# Altium schematic sheet PSFB_gate_driver_sch.SchDoc
size 420 x 297 mm; Address1: Address1; Address2: Address2; Address3: Address3; Address4: Address4; DocumentNumber: АБВГ.123456.001 Э3; SheetNumber: 1; Scale: 1:1; DocumentType: Схема электрическая принципиальная; FirstReferrence: АБВГ.123456.001
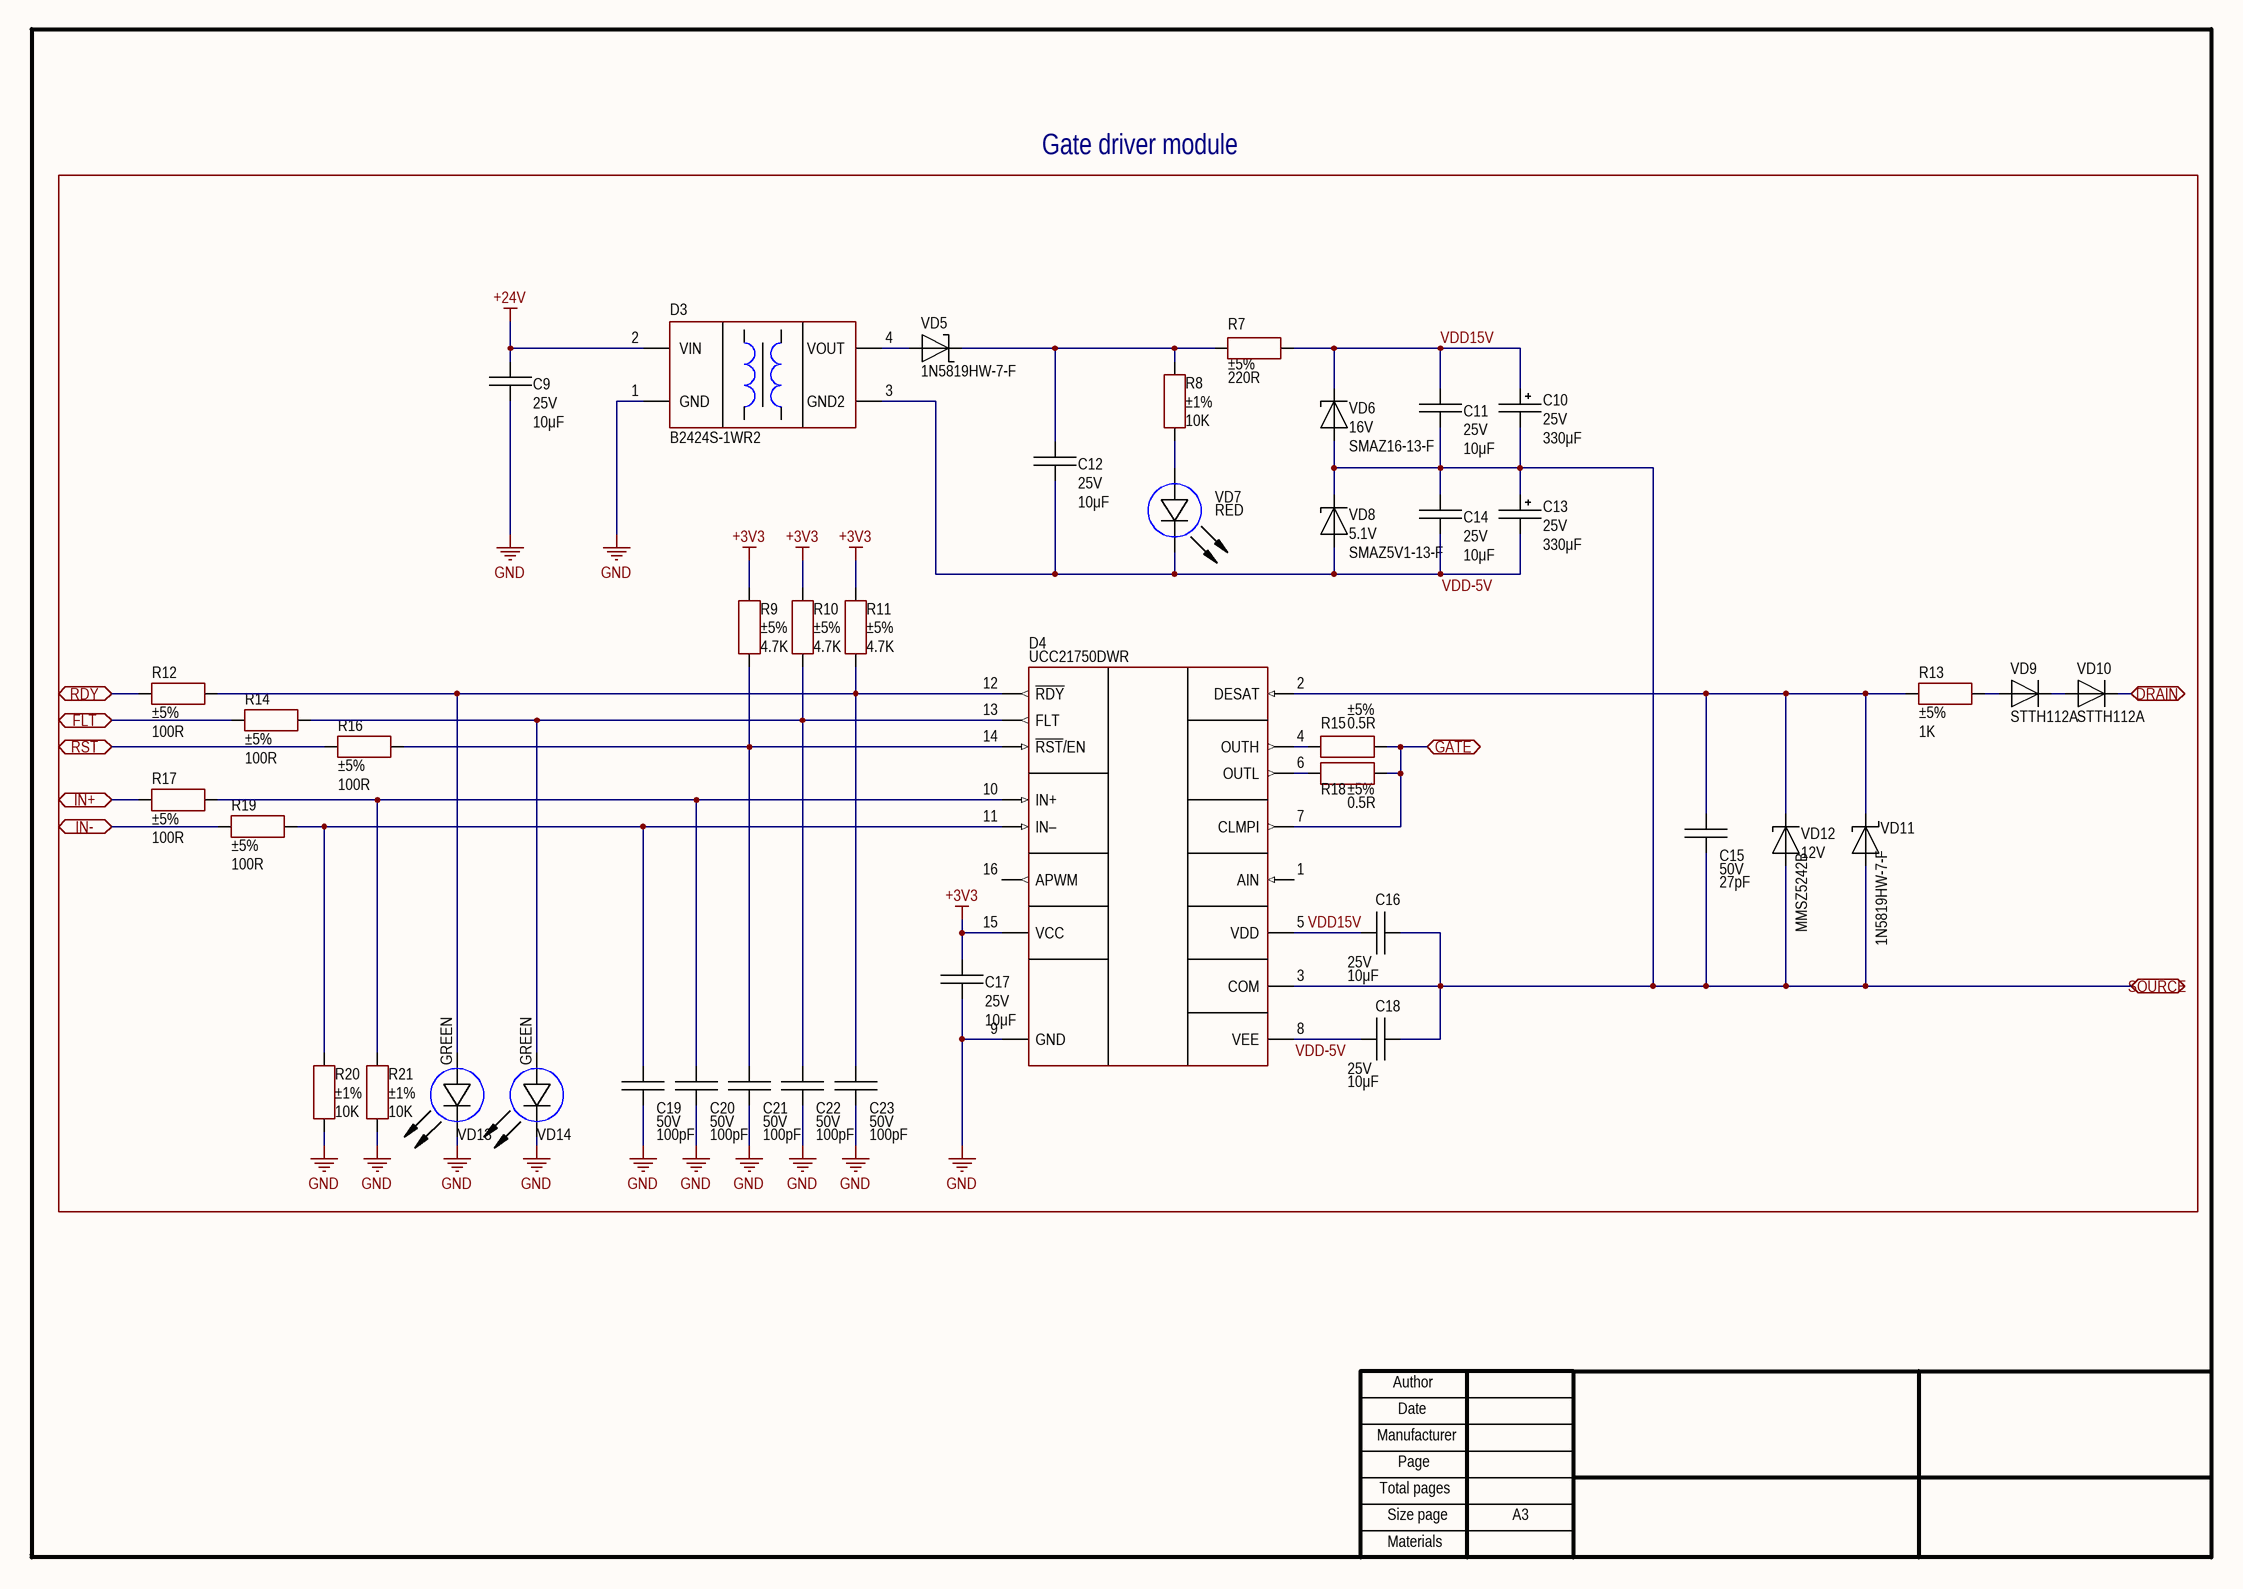
[diagram p0: PSFB_gate_driver_sch.SchDoc]

## Parts
C9  value 10μF  Voltage: 25V  [CAP: 1206]
C10  value 330μF  Voltage: 25V  [CAP: D8C3.5H12]
C11  value 10μF  Voltage: 25V  [CAP: 1206]
C12  value 10μF  Voltage: 25V  [CAP: 1206]
C13  value 330μF  Voltage: 25V  [CAP: D8C3.5H12]
C14  value 10μF  Voltage: 25V  [CAP: 1206]
C15  value 27pF  Voltage: 50V  [CAP: 0805]
C16  value 10μF  Voltage: 25V  [CAP: 1206]
C17  value 10μF  Voltage: 25V  [CAP: 1206]
C18  value 10μF  Voltage: 25V  [CAP: 1206]
C19  value 100pF  Voltage: 50V  [CAP: 0805]
C20  value 100pF  Voltage: 50V  [CAP: 0805]
C21  value 100pF  Voltage: 50V  [CAP: 0805]
C22  value 100pF  Voltage: 50V  [CAP: 0805]
C23  value 100pF  Voltage: 50V  [CAP: 0805]
D3  PartNumber: B2424S-1WR2  [MOD: SIP-4 (B0505S-1W)]
D4  (no value)  [16-SOIC]
R7  value 220R  Tolerance: ±5%  [RES: 2512]
R8  value 10K  Tolerance: ±1%  [RES: 0805]
R9  value 4.7K  Tolerance: ±5%  [RES: 0805]
R10  value 4.7K  Tolerance: ±5%  [RES: 0805]
R11  value 4.7K  Tolerance: ±5%  [RES: 0805]
R12  value 100R  Tolerance: ±5%  [RES: 0805]
R13  value 1K  Tolerance: ±5%  [RES: 0805]
R14  value 100R  Tolerance: ±5%  [RES: 0805]
R15  value 0.5R  Tolerance: ±5%  [RES: 2512]
R16  value 100R  Tolerance: ±5%  [RES: 0805]
R17  value 100R  Tolerance: ±5%  [RES: 0805]
R18  value 0.5R  Tolerance: ±5%  [RES: 2512]
R19  value 100R  Tolerance: ±5%  [RES: 0805]
R20  value 10K  Tolerance: ±1%  [RES: 0805]
R21  value 10K  Tolerance: ±1%  [RES: 0805]
VD5  PartNumber: 1N5819HW-7-F  [DIODE: SOD123]
VD6  Voltage: 16V  PartNumber: SMAZ16-13-F  [DIODE: SMA]
VD7  Color: RED  [LED: 0805R]
VD8  Voltage: 5.1V  PartNumber: SMAZ5V1-13-F  [DIODE: SMA]
VD9  PartNumber: STTH112A  [DIODE: SMA]
VD10  PartNumber: STTH112A  [DIODE: SMA]
VD11  PartNumber: 1N5819HW-7-F  [DIODE: SOD123]
VD12  Voltage: 12V  PartNumber: MMSZ5242B  [DIODE: SOD123]
VD13  Color: GREEN  [LED: 0805G]
VD14  Color: GREEN  [LED: 0805G]

## Blocks framed on the sheet
Gate driver module: C9-C23 D3 D4 R7-R21 VD5-VD14

## Ports
DRAIN (bidir), FLT (bidir), GATE (bidir), IN+ (bidir), IN- (bidir), RDY (bidir), RST (bidir), SOURCE (bidir)

## Nets
+3V3: C17.2 D4.15(VCC) R9.2 R10.2 R11.2
+24V: C9.2 D3.2(VIN)
GND: C9.1 C17.1 C19.1 C20.1 C21.1 C22.1 C23.1 D3.1(GND) D4.9(GND) R20.2 R21.2 VD13.2(C) VD14.2(C)
DRAIN: VD10.2 ; port DRAIN
FLT: R14.1 ; port FLT
GATE: D4.7(CLMPI) R15.2 R18.2 ; port GATE
IN+: R17.1 ; port IN+
IN-: R19.1 ; port IN-
RDY: R12.1 ; port RDY
RST: R16.1 ; port RST
SOURCE: C10.2 C11.2 C13.1 C14.1 C15.1 C16.1 C18.1 D4.3(COM) VD6.1(A) VD8.2(C) VD11.1 VD12.1(A) ; port SOURCE
VDD15V: C10.1 C11.1 C16.2 D4.5(VDD) R7.2 VD6.2(C)
VDD-5V: C12.1 C13.2 C14.2 C18.2 D3.3(GND2) D4.8(VEE) VD7.2(C) VD8.1(A)
NetC12_2: C12.2 R7.1 R8.2 VD5.2
NetC15_2: C15.2 D4.2(DESAT) R13.1 VD11.2 VD12.2(C)
NetC19_2: C19.2 D4.11(IN–) R19.2 R20.1
NetC20_2: C20.2 D4.10(IN+) R17.2 R21.1
NetC21_2: C21.2 D4.14(~{RST}/EN) R9.1 R16.2
NetC22_2: C22.2 D4.13(FLT) R10.1 R14.2 VD14.1(A)
NetC23_2: C23.2 D4.12(~{RDY}) R11.1 R12.2 VD13.1(A)
NetD3_4: D3.4(VOUT) VD5.1
NetD4_4: D4.4(OUTH) R15.1
NetD4_6: D4.6(OUTL) R18.1
NetR8_1: R8.1 VD7.1(A)
NetR13_2: R13.2 VD9.1
NetVD9_2: VD9.2 VD10.1

Not connected (* = marked no-connect by the designer): D4 1(AIN) 16(APWM)

## Notes on the sheet
- Author
- Manufacturer
- Date
- Page
- Total pages
- Size page
- A3
- Materials

## Library data of the parts
C9 C11 C12 C14 C16-C18 = Ceramic_1206: 10µF ±10% 25V Ceramic Capacitor X7R 1206 (3216 Metric); Manufacturer: Yageo; PartNumber: CC1206KKX7R8BB106; ValueManufacturerPartNumber: Ceramic capacitor, 10μF, X7R, ±10%, 25V, 1206, -55...+125°C; Package: 1206; HelpURL: https://www.digikey.com/en/products/detail/yageo/CC1206KKX7R8BB106/5195365; Temperature: -55...+125°C; TypeCapacitor: Ceramic capacitor; Tolerance: ±10%; TypeDielectric: X7R
C10 C13 = Aluminium: 330µF 25V Aluminum - Polymer Capacitors Radial, Can 18mOhm 2000 Hrs @ 105°C; Manufacturer: KEMET; PartNumber: A750KS337M1EAAE018; ValueManufacturerPartNumber: Aluminium capacitor, 330μF, 25V, ±20%, 18mOhm, 13x8x3.5 mm, -55...+105°C; TypeCapacitor: Aluminium capacitor; Tolerance: ±20%; Package: 13x8x3.5 mm; HelpURL: https://www.digikey.com/en/products/detail/kemet/A750KS337M1EAAE018/6196447; Temperature: -55...+105°C; Impedance: 18mOhm
C15 = Ceramic_0805: 27pF ±5% 50V Ceramic Capacitor C0G, NP0 0805 (2012 Metric); Manufacturer: Yageo; PartNumber: CC0805JRNPO9BN270; ValueManufacturerPartNumber: Ceramic capacitor, 27pF, NP0, ±10%, 50V, 0805, -55...+125°C; Tolerance: ±10%; Package: 0805; HelpURL: https://www.digikey.com/en/products/detail/yageo/CC0805JRNPO9BN270/302838; Temperature: -55...+125°C; TypeCapacitor: Ceramic capacitor; TypeDielectric: NP0
C19-C23 = Ceramic_0805: 100pF ±5% 50V Ceramic Capacitor C0G, NP0 0805 (2012 Metric); Manufacturer: Yageo; PartNumber: CC0805JRNPO9BN101; ValueManufacturerPartNumber: Ceramic capacitor, 100pF, NP0, ±10%, 50V, 0805, -55...+125°C; Tolerance: ±10%; Package: 0805; HelpURL: https://www.digikey.com/en/products/detail/yageo/CC0805JRNPO9BN101/302845; Temperature: -55...+125°C; TypeCapacitor: Ceramic capacitor; TypeDielectric: NP0
D3 = B0505S-1WR2: Isolated Module DC DC Converter 1 Output 24V 42mA 21.6V - 26.4V Input; Manufacturer: Mornsun; ValueManufacturerPartNumber: DC/DC converter, Isolator, 24V 42mA, -40...+105°C, SIP-4; OutputType: Isolator; HelpURL: https://www.chipdip.ru/product/b0505s-1wr2; Package: SIP-4; ComponentType: DC/DC converter; Temperature: -40...+105°C; OutputVoltage: 24V 42mA
D4 = UCC21750DWR: 10A Gate Driver Capacitive Coupling 5700Vrms 1 Channel 16-SOIC; Manufacturer: Texas Instruments; VoltageSupply: supply 3...5.5V; VoltageWork: 1200V; CMTI: 150kV/μs; HelpURL: https://www.digikey.com/en/products/detail/texas-instruments/UCC21750DWR/11502037; Package: 16-SOIC; ComponentType: Isolated gate driver; ValueManufacturerPartNumber: =ComponentType+', '+VoltageWork+', '+Frequency+', '+CurrentOutput+', '+CMTI+', '+VoltageSupply+', '+Temperature+', '+Package; Temperature: -40...+125°C; CurrentOutput: ±10A; PartNumber: UCC21750DWR
R7 = Resistor_2512: 220 Ohms ±5% 1W Chip Resistor 2512 (6432 Metric) Moisture Resistant Thick Film; Manufacturer: Yageo; PartNumber: RC2512JK-07220RL; ValueManufacturerPartNumber: Resistor film, 220R, ±5%, 2512, 1W, -55...+125°C; TypeResistor: Resistor film; Package: 2512; HelpURL: https://www.digikey.com/en/products/detail/yageo/RC2512JK-07220RL/5922529; Temperature: -55...+125°C; Power: 1W
R8 R20 R21 = Resistor_0805: 10 kOhms ±1% 0.125W, 1/8W Chip Resistor 0805 (2012 Metric) Moisture Resistant Thick Film; Manufacturer: Yageo; PartNumber: RC0805FR-0710KL; ValueManufacturerPartNumber: Resistor film, 10K, ±1%, 0805, 0.125W, -55...+125°C; TypeResistor: Resistor film; Package: 0805; HelpURL: https://www.digikey.com/en/products/detail/yageo/RC0805FR-0710KL/727535; Temperature: -55...+125°C; Power: 0.125W
R9-R11 = Resistor_0805: 4.7 kOhms ±5% 0.125W, 1/8W Chip Resistor 0805 (2012 Metric) Moisture Resistant Thick Film; Manufacturer: Yageo; PartNumber: RC0805JR-074K7L; ValueManufacturerPartNumber: Resistor film, 4.7K, ±5%, 0805, 0.125W, -55...+125°C; TypeResistor: Resistor film; Package: 0805; HelpURL: https://www.digikey.com/en/products/detail/yageo/RC0805JR-074K7L/728327; Temperature: -55...+125°C; Power: 0.125W
R12 R14 R16 R17 R19 = Resistor_0805: 100 Ohms ±5% 0.125W, 1/8W Chip Resistor 0805 (2012 Metric) Moisture Resistant Thick Film; Manufacturer: Yageo; PartNumber: RC0805JR-07100RL; ValueManufacturerPartNumber: Resistor film, 100R, ±5%, 0805, 0.125W, -55...+125°C; TypeResistor: Resistor film; Package: 0805; HelpURL: https://www.digikey.com/product-detail/en/yageo/RC0805JR-07100RL/311-100ARCT-ND/731185; Temperature: -55...+125°C; Power: 0.125W
R13 = Resistor_0805: 1 kOhms ±5% 0.125W, 1/8W Chip Resistor 0805 (2012 Metric) Moisture Resistant Thick Film; Manufacturer: Yageo; PartNumber: RC0805JR-071KL; ValueManufacturerPartNumber: Resistor film, 1K, ±5%, 0805, 0.125W, -55...+125°C; TypeResistor: Resistor film; Package: 0805; HelpURL: https://www.digikey.com/en/products/detail/yageo/RC0805JR-071KL/728218; Temperature: -55...+125°C; Power: 0.125W
R15 R18 = Resistor_2512: 500 mOhms ±5% 1W Chip Resistor 2512 (6432 Metric) Automotive AEC-Q200, Current Sense, Moisture Resistant Thick Film; Manufacturer: Yageo; PartNumber: RC2512JK-07100RL; ValueManufacturerPartNumber: Resistor film, 0.5R, ±5%, 2512, 1W, -55...+125°C; TypeResistor: Resistor film; Package: 2512; HelpURL: https://www.digikey.com/en/products/detail/yageo/RL2512JK-070R5L/5925490; Temperature: -55...+125°C; Power: 1W
VD5 VD11 = Schottky_single: Diode Schottky 40V 1A Surface Mount SOD-123C; Manufacturer: Diodes Incorporated; ValueManufacturerPartNumber: Schottky diode, 40V, 1A, 0.45V, 15pF, SOD-123, -55...+150°C; TypeDiode: Schottky diode; VoltageDrop: 0.45V; RecoveryTime: 15pF; Package: SOD-123; HelpURL: https://www.digikey.com/en/products/detail/diodes-incorporated/1N5819HW-7-F/814970; Temperature: -55...+150°C; Voltage: 40V; Current: 1A
VD6 = Zener_single: Zener Diode 16V 1W ±5% Surface Mount SMA; Manufacturer: Diodes Incorporated; ValueManufacturerPartNumber: Zener diode, 16V, 1W, 0.9V, 17Ohm, SMA, -55...+150°C; VoltageDrop: 0.9V; RecoveryTime: 17Ohm; Package: SMA; HelpURL: https://www.digikey.com/en/products/detail/diodes-incorporated/SMAZ16-13-F/808526; Temperature: -55...+150°C; TypeDiode: Zener diode; Current: 1W
VD7 = LED_single: Red 631nm LED Indication - Discrete 2V 0805 (2012 Metric); Manufacturer: Lite-On Inc.; ValueManufacturerPartNumber: LED, Red, 20mA, 2V, 0805, -55...+150°C; PartNumber: LTST-C171KRKT; Current: 20mA; Package: 0805; HelpURL: https://www.digikey.com/en/products/detail/lite-on-inc/LTST-C171KRKT/386801; Temperature: -55...+150°C; TypeDiode: LED; VoltageDrop: 2V; ColorParameter: Red
VD8 = Zener_single: Zener Diode 5.1V 1W ±5% Surface Mount SMA; Manufacturer: Diodes Incorporated; ValueManufacturerPartNumber: Zener diode, 5.1V, 1W, 0.9V, 17Ohm, SMA, -55...+150°C; VoltageDrop: 0.9V; RecoveryTime: 17Ohm; Package: SMA; HelpURL: https://www.digikey.com/en/products/detail/diodes-incorporated/SMAZ5V1-13-F/725036; Temperature: -55...+150°C; TypeDiode: Zener diode; Current: 1W
VD9 VD10 = Diode_single: Diode Standard 1200V 1A Surface Mount SMA; Manufacturer: STMicroelectronics; ValueManufacturerPartNumber: Single diode, 1200V, 1A, 1.9V, 75ns, SMA, -55...+150°C; TypeDiode: Single diode; VoltageDrop: 1.9V; RecoveryTime: 75ns; Package: SMA; HelpURL: https://www.digikey.com/en/products/detail/stmicroelectronics/STTH112A/1039767; Temperature: -55...+150°C; Voltage: 1200V; Current: 1A
VD12 = Zener_single: Zener Diode 12V 500mW ±5% Surface Mount SOD-123; Manufacturer: Diodes Incorporated; ValueManufacturerPartNumber: Zener diode, 12V, 500mW, 0.9V, 17Ohm, SOD-123, -55...+150°C; VoltageDrop: 0.9V; RecoveryTime: 17Ohm; Package: SOD-123; HelpURL: https://www.digikey.com/en/products/detail/on-semiconductor/MMSZ5242B/1048676; Temperature: -55...+150°C; TypeDiode: Zener diode; Current: 500mW
VD13 VD14 = LED_single: Green 571nm LED Indication - Discrete 2V 0805 (2012 Metric); Manufacturer: Lite-On Inc.; ValueManufacturerPartNumber: LED, Green, 20mA, 2V, 0805, -55...+150°C; PartNumber: LTST-C170GKT; Current: 20mA; Package: 0805; HelpURL: https://www.digikey.com/en/products/detail/lite-on-inc/LTST-C171KGKT/386799; Temperature: -55...+150°C; TypeDiode: LED; VoltageDrop: 2V; ColorParameter: Green